# EAGLE design GameboyCartridgeKS (EAGLE 6.3)
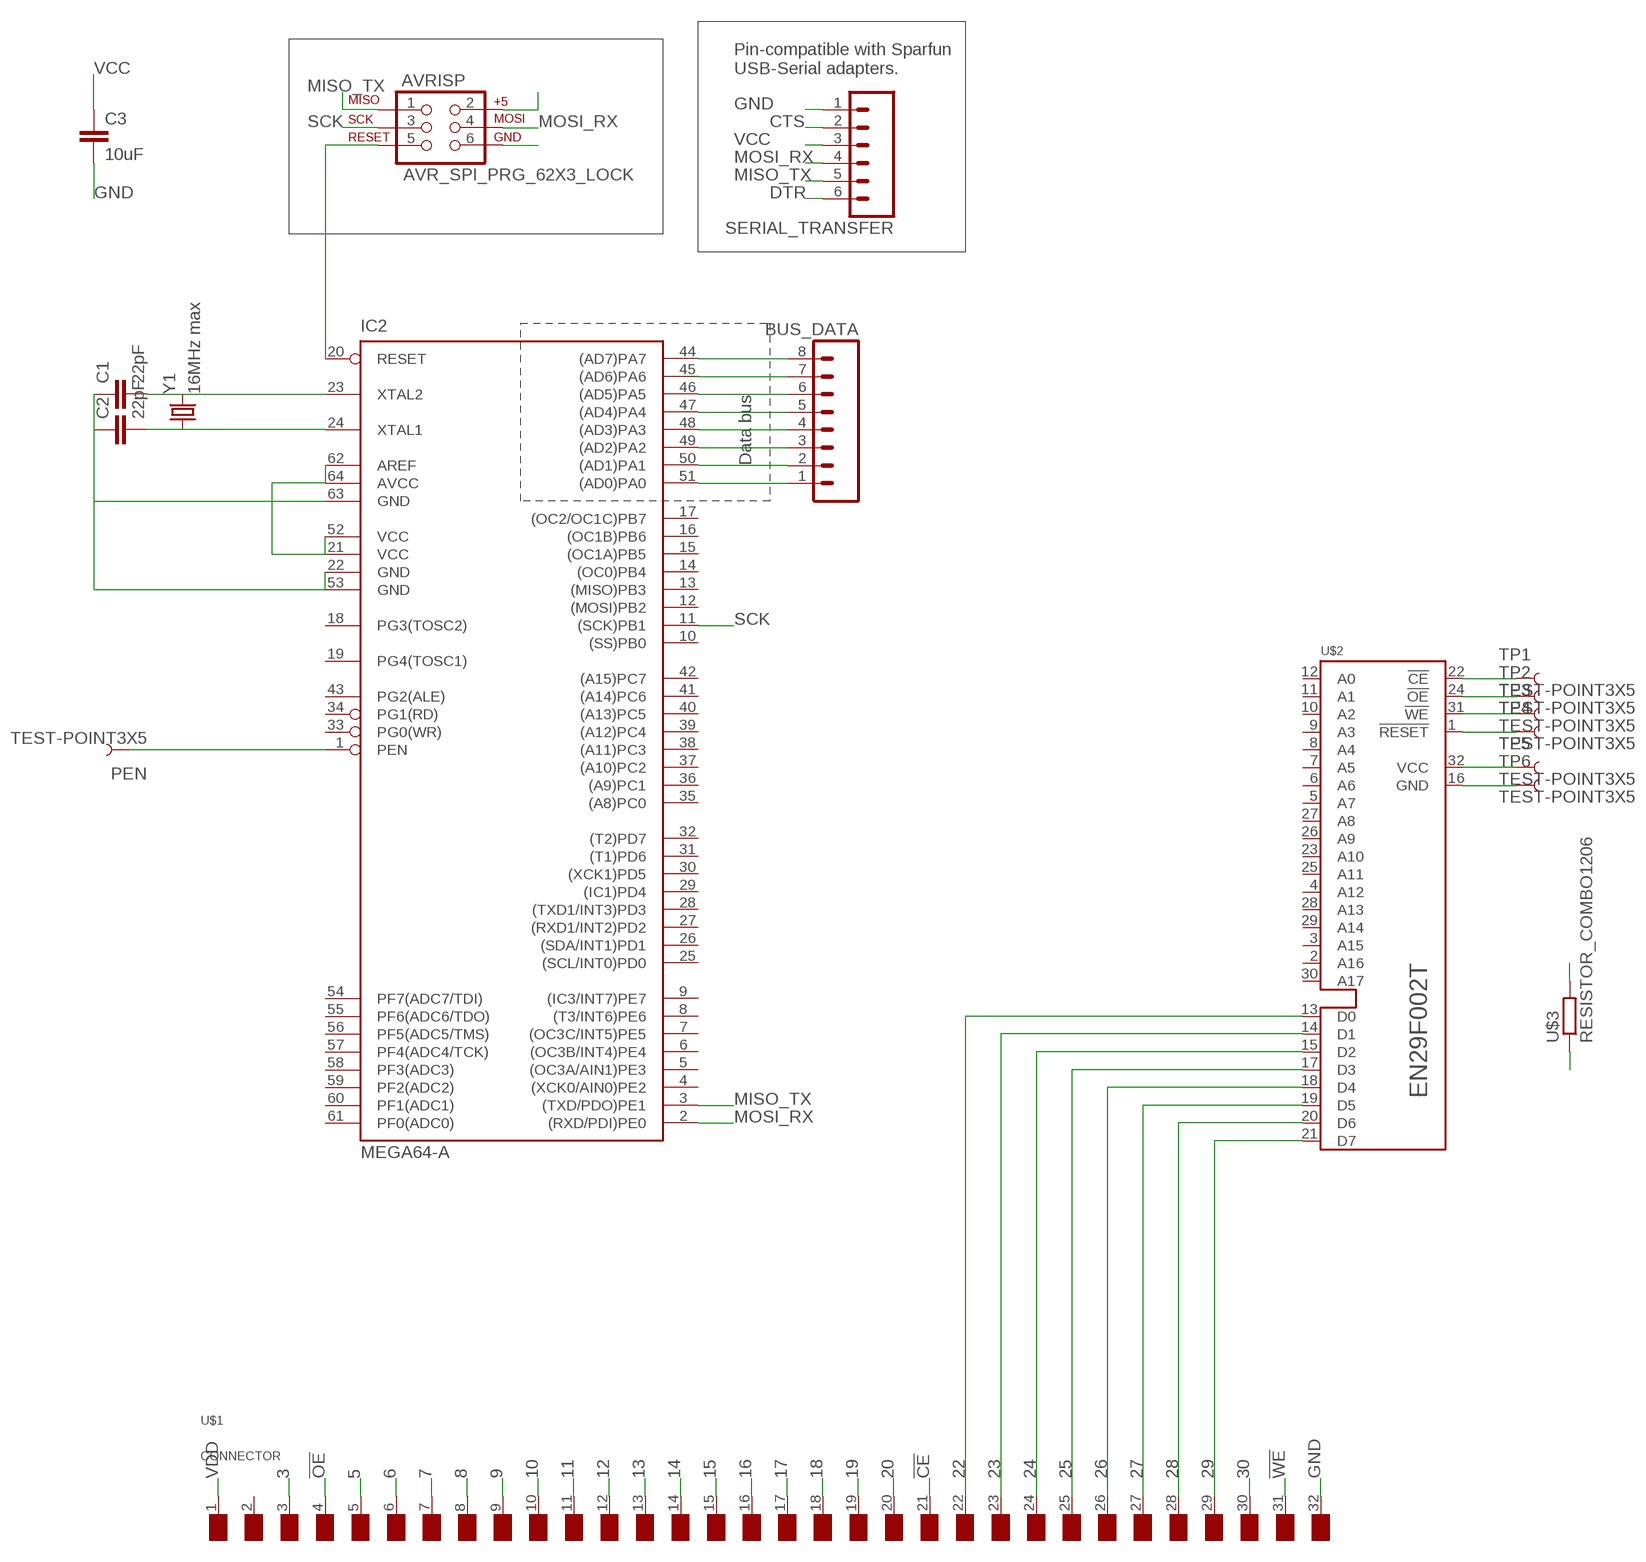
[diagram p0: schematic, sheet 1]

## Parts
AVRISP  AVR_SPI_PRG_62X3_LOCK  [2X3_LOCK]
BUS_DATA  M08NO_SILK  [1X08_PIN1_NO_SILK]
C1  22pF  C-EUC0805K  [C0805K]
C2  22pF  C-EUC0805K  [C0805K]
C3  10uF  C-EUC1206K  [C1206K]
IC2  MEGA64-A  [TQFP64]
PEN  TEST-POINT3X5  [PAD.03X.05]
SERIAL_TRANSFER  M06SILK_FEMALE_PTH  [1X06]
TP1  TEST-POINT3X5  [PAD.03X.05]
TP2  TEST-POINT3X5  [PAD.03X.05]
TP3  TEST-POINT3X5  [PAD.03X.05]
TP4  TEST-POINT3X5  [PAD.03X.05]
TP5  TEST-POINT3X5  [PAD.03X.05]
TP6  TEST-POINT3X5  [PAD.03X.05]
U$1  CONNECTOR  [CONNECTOR]
U$2  EN29F002T  [PLCC-S32]
U$3  RESISTOR_COMBO1206  [207-10_SMD_COMBO]
Y1  16MHz max  CRYSTALHC49UV  [HC49U-V]

## Nets
3: U$1.3(/WR)
5: U$1.5(/RCS)
6: U$1.6(A0)
7: U$1.7(A1)
8: U$1.8(A2)
9: U$1.9(A3)
10: U$1.10(A4)
11: U$1.11(A5)
12: U$1.12(A6)
13: U$1.13(A7)
14: U$1.14(A8)
15: U$1.15(A9)
16: U$1.16(A10)
17: U$1.17(A11)
18: U$1.18(A12)
19: U$1.19(A13)
20: U$1.20(A14)
22: BUS_DATA.1 IC2.51((AD0)PA0) U$1.22(D0) U$2.13(D0)
23: BUS_DATA.2 IC2.50((AD1)PA1) U$1.23(D1) U$2.14(D1)
24: BUS_DATA.3 IC2.49((AD2)PA2) U$1.24(D2) U$2.15(D2)
25: BUS_DATA.4 IC2.48((AD3)PA3) U$1.25(D3) U$2.17(D3)
26: BUS_DATA.5 IC2.47((AD4)PA4) U$1.26(D4) U$2.18(D4)
27: BUS_DATA.6 IC2.46((AD5)PA5) U$1.27(D5) U$2.19(D5)
28: BUS_DATA.7 IC2.45((AD6)PA6) U$1.28(D6) U$2.20(D6)
29: BUS_DATA.8 IC2.44((AD7)PA7) U$1.29(D7) U$2.21(D7)
30: U$1.30(/RS)
!CE: TP1.P$1 U$1.21(A15) U$2.22(!CE)
!OE: TP2.P$1 U$1.4(/RD) U$2.24(!OE)
!RESET: TP4.P$1 U$2.1(!RESET)
!WE: TP3.P$1 U$1.31(VIN) U$2.31(!WE) U$3.1 U$3.4
CTS: SERIAL_TRANSFER.2
DTR: SERIAL_TRANSFER.6
GND: AVRISP.6 C1.1 C2.1 C3.2 IC2.22(GND) IC2.53(GND) IC2.63(GND) SERIAL_TRANSFER.1 TP6.P$1 U$1.32(GND) U$2.16(GND)
MISO_TX: AVRISP.1 IC2.3((TXD/PDO)PE1) SERIAL_TRANSFER.5
MOSI_RX: AVRISP.4 IC2.2((RXD/PDI)PE0) SERIAL_TRANSFER.4
N$2: C1.2 IC2.23(XTAL2) Y1.2
N$3: AVRISP.5 IC2.20(RESET)
N$4: C2.2 IC2.24(XTAL1) Y1.1
PEN: IC2.1(PEN) PEN.P$1
SCK: AVRISP.3 IC2.11((SCK)PB1)
VCC: AVRISP.2 C3.1 IC2.21(VCC) IC2.52(VCC) IC2.62(AREF) IC2.64(AVCC) SERIAL_TRANSFER.3 TP5.P$1 U$2.32(VCC) U$3.2 U$3.3
VDD: U$1.1(VDD)
Unconnected: IC2.4((XCK0/AIN0)PE2) IC2.5((OC3A/AIN1)PE3) IC2.6((OC3B/INT4)PE4) IC2.7((OC3C/INT5)PE5) IC2.8((T3/INT6)PE6) IC2.9((IC3/INT7)PE7) IC2.10((SS)PB0) IC2.12((MOSI)PB2) IC2.13((MISO)PB3) IC2.14((OC0)PB4) IC2.15((OC1A)PB5) IC2.16((OC1B)PB6) IC2.17((OC2/OC1C)PB7) IC2.18(PG3(TOSC2)) IC2.19(PG4(TOSC1)) IC2.25((SCL/INT0)PD0) IC2.26((SDA/INT1)PD1) IC2.27((RXD1/INT2)PD2) IC2.28((TXD1/INT3)PD3) IC2.29((IC1)PD4) IC2.30((XCK1)PD5) IC2.31((T1)PD6) IC2.32((T2)PD7) IC2.33(PG0(WR)) IC2.34(PG1(RD)) IC2.35((A8)PC0) IC2.36((A9)PC1) IC2.37((A10)PC2) IC2.38((A11)PC3) IC2.39((A12)PC4) IC2.40((A13)PC5) IC2.41((A14)PC6) IC2.42((A15)PC7) IC2.43(PG2(ALE)) IC2.54(PF7(ADC7/TDI)) IC2.55(PF6(ADC6/TDO)) IC2.56(PF5(ADC5/TMS)) IC2.57(PF4(ADC4/TCK)) IC2.58(PF3(ADC3)) IC2.59(PF2(ADC2)) IC2.60(PF1(ADC1)) IC2.61(PF0(ADC0)) U$1.2(NC) U$2.2(A16) U$2.3(A15) U$2.4(A12) U$2.5(A7) U$2.6(A6) U$2.7(A5) U$2.8(A4) U$2.9(A3) U$2.10(A2) U$2.11(A1) U$2.12(A0) U$2.23(A10) U$2.25(A11) U$2.26(A9) U$2.27(A8) U$2.28(A13) U$2.29(A14) U$2.30(A17)

## Notes on the sheet
- Pin-compatible with Sparfun 
  USB-Serial adapters.
- Data bus

## Library data of the parts
AVRISP = SparkFun-Connectors:AVR_SPI_PRG_6: AVR ISP 6 Pin This is the reduced ISP connector for AVR programming. Common on Arduino. This footprint will take up less PCB space and can be used with a 10-pin to 6-pin adapter such as SKU: BOB-08508 **Special note about "TEST_POINT" package. The stop mask is on the top side, so if you want your programming test points to be on the bottom of your board, make sure to place this package on the bottom side of the board. This also ensure that the orientation to program from the bottom side will be correct.
BUS_DATA = SparkFun-Connectors:M08: Header 8 Standard 8-pin 0.1" header. Use with straight break away headers (SKU : PRT-00116), right angle break away headers (PRT-00553), swiss pins (PRT-00743), machine pins (PRT-00117), and female headers (PRT-00115).
C1-C3 = resistor:C-EU: CAPACITOR, European symbol
IC2 = atmel:MEGA64: MICROCONTROLLER 64 Kbytes FLASH 4 Kbytes SRAM 2 Kbytes EEPROM DUAL USART 8-channel 10 bit ADC Source: avr.lbr; MPN: ATMEGA64-16AU; OC_FARNELL: 9171355; OC_NEWARK: 01M6899
PEN TP1-TP6 = SparkFun-Passives:TEST-POINT: Bare copper test points for troubleshooting or ICT
SERIAL_TRANSFER = SparkFun-Connectors:M06: Header 6 Standard 6-pin 0.1" header. Use with straight break away headers (SKU : PRT-00116), right angle break away headers (PRT-00553), swiss pins (PRT-00743), machine pins (PRT-00117), and female headers (PRT-00115). Molex polarized connector foot print use with SKU : PRT-08094 with associated crimp pins and housings. NOTES ON THE VARIANTS LOCK and LOCK_LONGPADS... This footprint was designed to help hold the alignment of a through-hole component (i.e. 6-pin header) while soldering it into place. You may notice that each hole has been shifted either up or down by 0.005 of an inch from it's more standard position (which is a perfectly straight line). This slight alteration caused the pins (the squares in the middle) to touch the edges of the holes. Because they are alternating, it causes a "brace" to hold the component in place. 0.005 has proven to be the perfect amount of "off-center" position when using our standard breakaway headers. Although looks a little odd when you look at the bare footprint, once you have a header in there, the alteration is very hard to notice. Also,if you push a header all the way into place, it is covered up entirely on the bottom side. This idea of altering the position of holes to aid alignment will be further integrated into the Sparkfun Library for other footprints. It can help hold any component with 3 or more connection pins.; PROD_ID: CONN-08437
U$1 = gameboy:CONNECTOR: Connector Pads for Gameboy Cartridges
U$2 = kalshagar:EN29F002T: 2 MB flash memory in PLCC-S32 package.
U$3 = kalshagar:RESISTOR_COMBO1206
Y1 = SparkFun-FreqCtrl:CRYSTAL: Various standard crystals. Proven footprints.

## Board
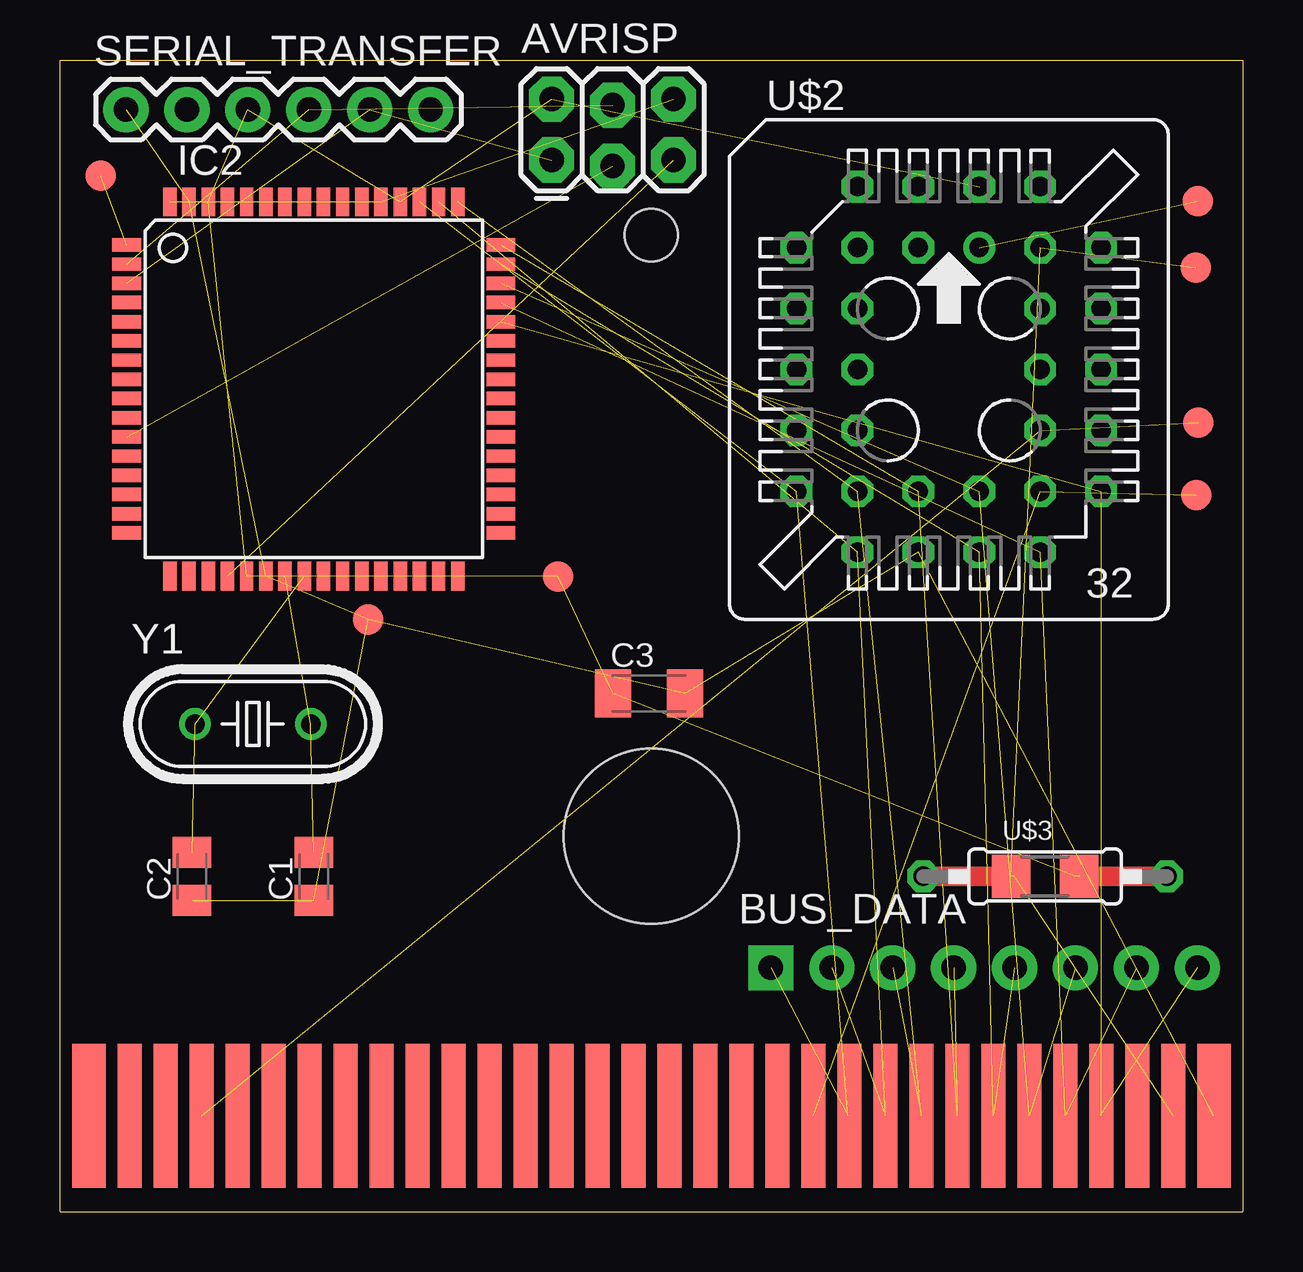
[diagram p1: board, top side]

Size 49.3 x 48 mm. Coordinates in mm from the lower left corner, seen from the top.
Outline: 49.3,48 49.3,0 0,0 0,48 49.3,48
Copper layers (1*16): Top 0.035mm / dielectric 1.5mm / Bottom 0.035mm
Design rules "default": minimum track width 6mil, minimum drill 12mil, track to track 6mil, track to pad 6mil, pad to pad 6mil, via to via 6mil, smd to smd 0mil, copper to edge 10mil, drill to drill 10mil, minimum pad ring 10mil, minimum via ring 6mil, stop-mask expansion 2mil, vias tented up to drill 100mil, thermal gap 10mil
Holes 7.3 mm at 24.65,15.65
Holes 2.2 mm at 24.65,40.7

### Footprints (pad centres in the part's own frame; a part is rotated, then mirrored left to right if it is on the bottom)
2X3_LOCK = drill 1.016 pad 1.88 octagon: 1 0,0; 2 0,2.54; 3 2.54,-0.254; 4 2.54,2.286; 5 5.08,0; 6 5.08,2.54
1X08_PIN1_NO_SILK = drill 1.016 pad 1.88 square: 1 0,0 | drill 1.016 pad 1.88: 2 2.54,0; 3 5.08,0; 4 7.62,0; 5 10.16,0; 6 12.7,0; 7 15.24,0; 8 17.78,0
C0805K = smd 1.3 x 1.6: 1 -1,0; 2 1,0
C1206K = smd 1.5 x 2: 1 -1.5,0; 2 1.5,0
TQFP64 = smd 1.194 x 0.559: 1 -7.8,6; 2 -7.8,5.2; 3 -7.8,4.4; 4 -7.8,3.6; 5 -7.8,2.8; 6 -7.8,2; 7 -7.8,1.2; 8 -7.8,0.4; 9 -7.8,-0.4; 10 -7.8,-1.2; 11 -7.8,-2; 12 -7.8,-2.8; 13 -7.8,-3.6; 14 -7.8,-4.4; 15 -7.8,-5.2; 16 -7.8,-6; 33 7.8,-6; 34 7.8,-5.2; 35 7.8,-4.4; 36 7.8,-3.6; 37 7.8,-2.8; 38 7.8,-2; 39 7.8,-1.2; 40 7.8,-0.4; 41 7.8,0.4; 42 7.8,1.2; 43 7.8,2; 44 7.8,2.8; 45 7.8,3.6; 46 7.8,4.4; 47 7.8,5.2; 48 7.8,6 | smd 0.559 x 1.194: 17 -6,-7.8; 18 -5.2,-7.8; 19 -4.4,-7.8; 20 -3.6,-7.8; 21 -2.8,-7.8; 22 -2,-7.8; 23 -1.2,-7.8; 24 -0.4,-7.8; 25 0.4,-7.8; 26 1.2,-7.8; 27 2,-7.8; 28 2.8,-7.8; 29 3.6,-7.8; 30 4.4,-7.8; 31 5.2,-7.8; 32 6,-7.8; 49 6,7.8; 50 5.2,7.8; 51 4.4,7.8; 52 3.6,7.8; 53 2.8,7.8; 54 2,7.8; 55 1.2,7.8; 56 0.4,7.8; 57 -0.4,7.8; 58 -1.2,7.8; 59 -2,7.8; 60 -2.8,7.8; 61 -3.6,7.8; 62 -4.4,7.8; 63 -5.2,7.8; 64 -6,7.8
PAD.03X.05 = smd 1.27 x 1.27: P$1 0,0
1X06 = drill 1.016 pad 1.88: 1 0,0; 2 2.54,0; 3 5.08,0; 4 7.62,0; 5 10.16,0; 6 12.7,0
CONNECTOR = smd 1.4 x 6: 1 0.7,-3; 32 47.6,-3 | smd 1 x 6: 2 2.4,-3; 3 3.9,-3; 4 5.4,-3; 5 6.9,-3; 6 8.4,-3; 7 9.9,-3; 8 11.4,-3; 9 12.9,-3; 10 14.4,-3; 11 15.9,-3; 12 17.4,-3; 13 18.9,-3; 14 20.4,-3; 15 21.9,-3; 16 23.4,-3; 17 24.9,-3; 18 26.4,-3; 19 27.9,-3; 20 29.4,-3; 21 30.9,-3; 22 32.4,-3; 23 33.9,-3; 24 35.4,-3; 25 36.9,-3; 26 38.4,-3; 27 39.9,-3; 28 41.4,-3; 29 42.9,-3; 30 44.4,-3; 31 45.9,-3
PLCC-S32 = drill 0.813: 1 1.27,5.08 | drill 0.813 octagon: 2 -1.27,7.62; 3 -1.27,5.08; 4 -3.81,7.62; 5 -6.35,5.08; 6 -3.81,5.08; 7 -6.35,2.54; 8 -3.81,2.54; 9 -6.35,0; 10 -3.81,0; 11 -6.35,-2.54; 12 -3.81,-2.54; 13 -6.35,-5.08; 14 -3.81,-7.62; 15 -3.81,-5.08; 16 -1.27,-7.62; 17 -1.27,-5.08; 18 1.27,-7.62; 19 1.27,-5.08; 20 3.81,-7.62; 21 6.35,-5.08; 22 3.81,-5.08; 23 6.35,-2.54; 24 3.81,-2.54; 25 6.35,0; 26 3.81,0; 27 6.35,2.54; 28 3.81,2.54; 29 6.35,5.08; 30 3.81,7.62; 31 3.81,5.08; 32 1.27,7.62
207-10_SMD_COMBO = drill 0.813 octagon: 1 -5.08,0; 2 5.08,0 | smd 1.6 x 1.803: 3 1.422,0; 4 -1.422,0
HC49U-V = drill 0.813: 1 -2.413,0; 2 2.413,0

### Placement (x,y rotation side)
AVRISP  20.49,43.83 0 top
BUS_DATA  29.63,10.16 0 top
C1  10.58,13.97 90 top
C2  5.5,13.97 90 top
C3  24.55,21.59 0 top
IC2  10.58,34.29 0 top
PEN  1.69,43.18 0 top
SERIAL_TRANSFER  2.75,45.93 0 top
TP1  47.37,29.86 0 top
TP2  47.45,32.89 0 top
TP3  47.34,39.34 0 top
TP4  47.42,42.11 0 top
TP5  20.77,26.47 0 top
TP6  12.85,24.67 0 top
U$1  0.5,7 0 top
U$2  37.05,35.1 0 top
U$3  41.06,13.97 0 top
Y1  8.04,20.32 0 top

### Tracks (layer width: path | path; a pad name or v marks a point on that pad's centre or on a via)
11
  Top 0.152: 16.45,4 U$1.11
20
  Top 0.152: 29.95,4 U$1.20
22  (3 unrouted)
  Top 0.152: 32.85,4 U$1.22
23  (3 unrouted)
24  (3 unrouted)
25  (3 unrouted)
26  (3 unrouted)
27  (3 unrouted)
28  (3 unrouted)
29  (3 unrouted)
  Top 0.152: 43.35,4 U$1.29
!CE  (2 unrouted)
!OE  (2 unrouted)
!RESET  (1 unrouted)
!WE  (4 unrouted)
GND  (10 unrouted)
MISO_TX  (2 unrouted)
MOSI_RX  (2 unrouted)
N$2  (2 unrouted)
N$3  (1 unrouted)
N$4  (2 unrouted)
PEN  (1 unrouted)
SCK  (1 unrouted)
VCC  (10 unrouted)